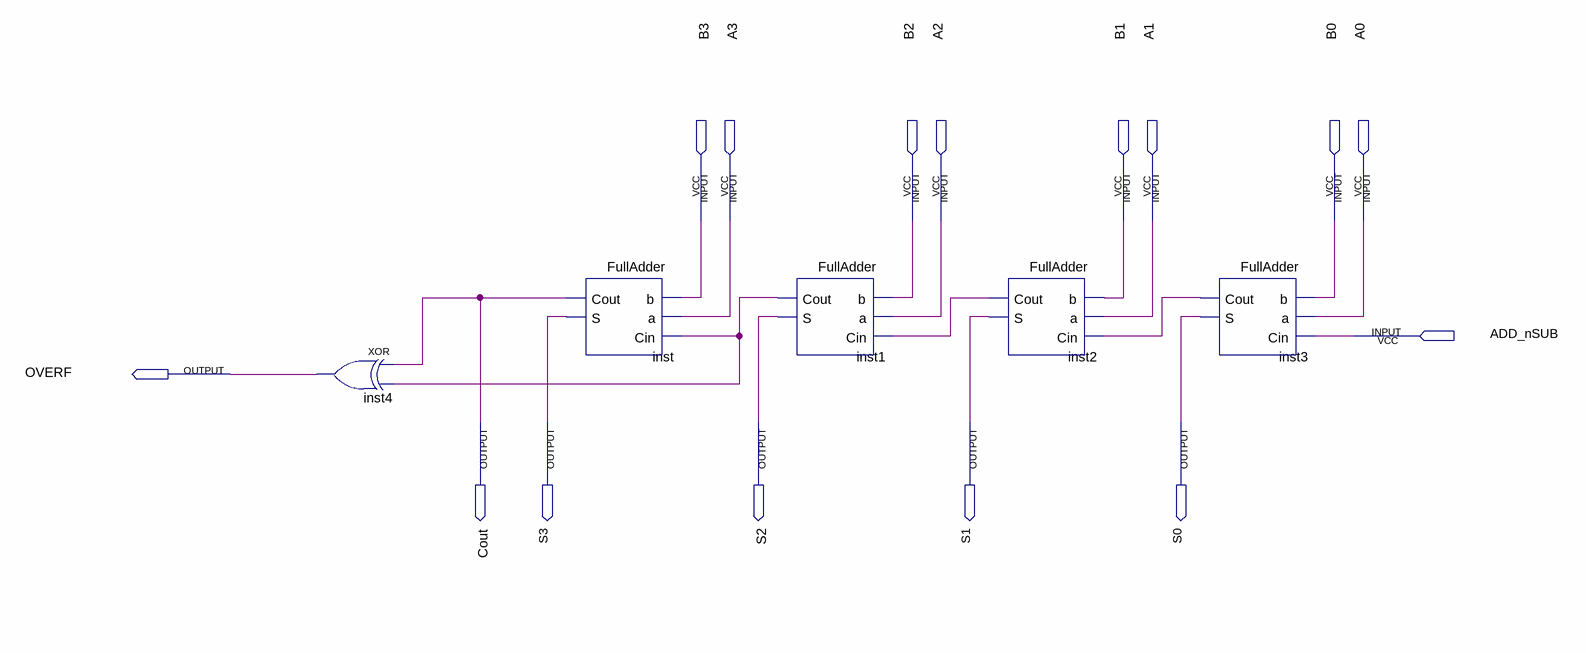
[diagram p0: schematic sheet]
// Quartus schematic AddSub4.bdf as structural Verilog: 5 symbols, 15 pins
module AddSub4 (
  input  B3,
  input  A3,
  input  B2,
  input  A2,
  input  B1,
  input  A1,
  input  B0,
  input  A0,
  input  ADD_nSUB,
  output OVERF,
  output Cout,
  output S3,
  output S2,
  output S1,
  output S0
);

  wire inst1_cout, inst2_cout, inst3_cout;

  xor inst4 (OVERF, Cout, inst1_cout);
  FullAdder inst (.b(B3), .a(A3), .Cin(inst1_cout), .Cout(Cout), .S(S3));
  FullAdder inst1 (.b(B2), .a(A2), .Cin(inst2_cout), .Cout(inst1_cout), .S(S2));
  FullAdder inst2 (.b(B1), .a(A1), .Cin(inst3_cout), .Cout(inst2_cout), .S(S1));
  FullAdder inst3 (.b(B0), .a(A0), .Cin(ADD_nSUB), .Cout(inst3_cout), .S(S0));
endmodule
